# EAGLE design watch_rev3 (EAGLE 6.6.0)
Pulsar P3 Replacement Module 'Odin' made by Roy Schneider 2020
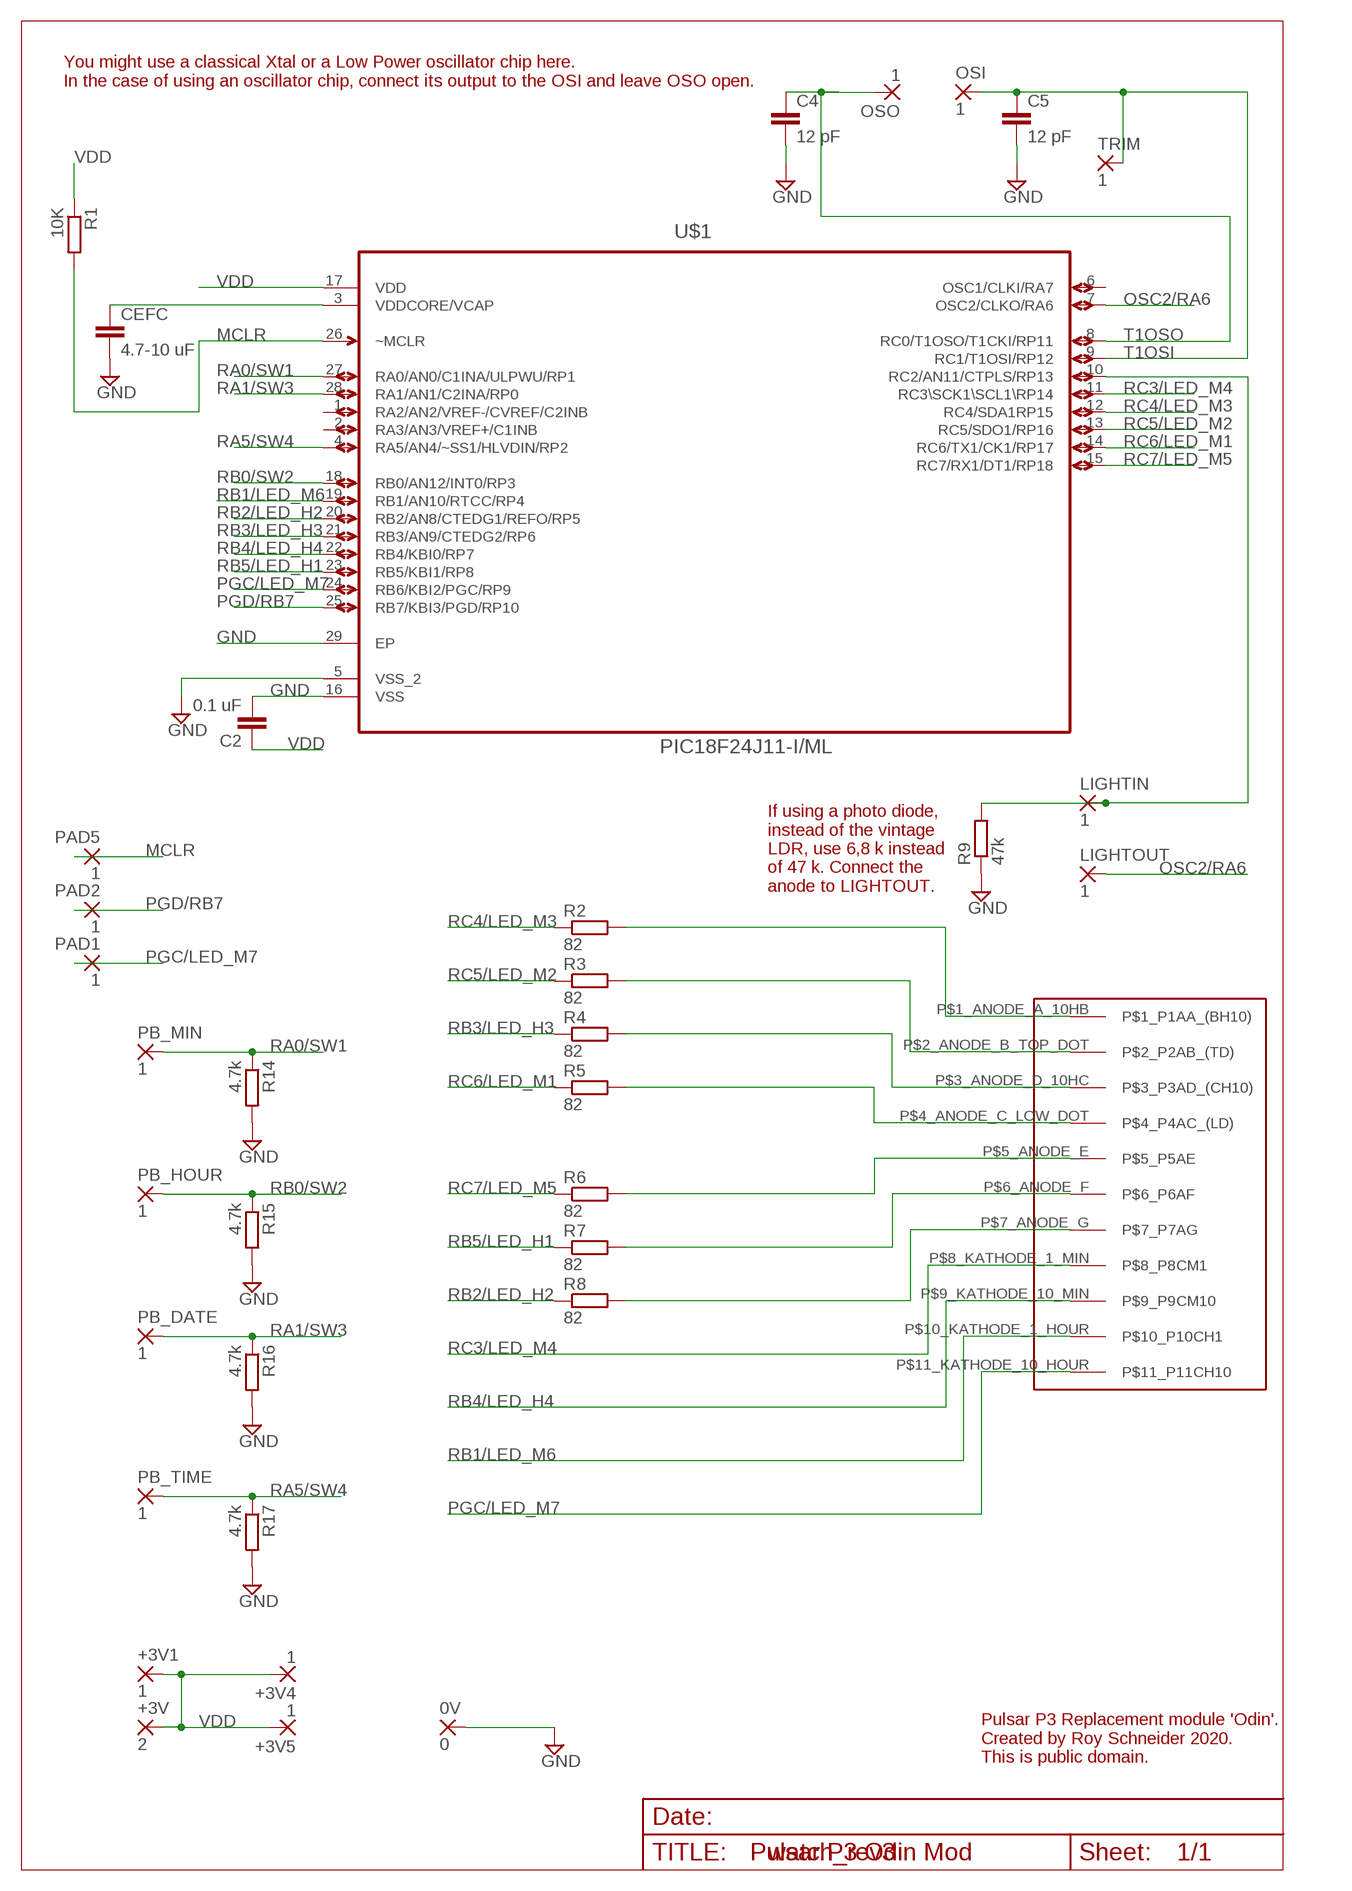
[diagram p0: schematic, sheet 1]

## Parts
0V  0  SMD2  [SMD1,27-2,54]
+3V  2  SMD2  [SMD1,27-2,54]
+3V1  1  SMD2  [SMD1,27-2,54]
+3V4  1  SMD2  [SMD1,27-2,54]
+3V5  1  SMD2  [SMD1,27-2,54]
C2  0.1 uF  C-EUC0603  [C0603]
C4  12 pF  C-EUC0603  [C0603]
C5  12 pF  C-EUC0603  [C0603]
CEFC  4.7-10 uF  C-EUC0603  [C0603]
LIGHTIN  1  SMD2  [SMD1,27-2,54]
LIGHTOUT  1  SMD2  [SMD1,27-2,54]
OSI  1  SMD2  [SMD1,27-2,54]
OSO  1  SMD2  [SMD1,27-2,54]
PAD1  1  SMD2  [SMD1,27-2,54]
PAD2  1  SMD2  [SMD1,27-2,54]
PAD5  1  SMD2  [SMD1,27-2,54]
PB_DATE  1  SMD2  [SMD1,27-2,54]
PB_HOUR  1  SMD2  [SMD1,27-2,54]
PB_MIN  1  SMD2  [SMD1,27-2,54]
PB_TIME  1  SMD2  [SMD1,27-2,54]
R1  10K  R-EU_R0402  [R0402]
R2  82  R-EU_R0402  [R0402]
R3  82  R-EU_R0402  [R0402]
R4  82  R-EU_R0402  [R0402]
R5  82  R-EU_R0402  [R0402]
R6  82  R-EU_R0402  [R0402]
R7  82  R-EU_R0402  [R0402]
R8  82  R-EU_R0402  [R0402]
R9  47k  R-EU_R0402  [R0402]
R14  4.7k  R-EU_R0402  [R0402]
R15  4.7k  R-EU_R0402  [R0402]
R16  4.7k  R-EU_R0402  [R0402]
R17  4.7k  R-EU_R0402  [R0402]
TRIM  1  SMD2  [SMD1,27-2,54]
U$1  PIC18F24J11-I/ML  [QFN65P600X600X100-29N]
U$3  PULSAR_P3_DISPLAY  [PULSAR_P3_LED_DISPLAY]

## Nets
GND: 0V.1(P) C2.2 C4.2 C5.2 CEFC.2 R9.1 R14.2 R15.2 R16.2 R17.2 U$1.5(VSS_2) U$1.16(VSS) U$1.29(EP)
MCLR: PAD5.1(P) R1.2 U$1.26(~MCLR)
N$1: LIGHTIN.1(P) R9.2 U$1.10(RC2/AN11/CTPLS/RP13)
N$2: R2.2 U$3.P$1_ANODE_A_10HB(P$1_P1AA_(BH10))
N$3: R3.2 U$3.P$2_ANODE_B_TOP_DOT(P$2_P2AB_(TD))
N$6: R4.2 U$3.P$3_ANODE_D_10HC(P$3_P3AD_(CH10))
N$7: R5.2 U$3.P$4_ANODE_C_LOW_DOT(P$4_P4AC_(LD))
N$8: R6.2 U$3.P$5_ANODE_E(P$5_P5AE)
N$9: R7.2 U$3.P$6_ANODE_F(P$6_P6AF)
N$10: R8.2 U$3.P$7_ANODE_G(P$7_P7AG)
OSC2/RA6: LIGHTOUT.1(P) U$1.7(OSC2/CLKO/RA6)
PGC/LED_M7: PAD1.1(P) U$1.24(RB6/KBI2/PGC/RP9) U$3.P$11_KATHODE_10_HOUR(P$11_P11CH10)
PGD/RB7: PAD2.1(P) U$1.25(RB7/KBI3/PGD/RP10)
RA0/SW1: PB_MIN.1(P) R14.1 U$1.27(RA0/AN0/C1INA/ULPWU/RP1)
RA1/SW3: PB_DATE.1(P) R16.1 U$1.28(RA1/AN1/C2INA/RP0)
RA5/SW4: PB_TIME.1(P) R17.1 U$1.4(RA5/AN4/~SS1/HLVDIN/RP2)
RB0/SW2: PB_HOUR.1(P) R15.1 U$1.18(RB0/AN12/INT0/RP3)
RB1/LED_M6: U$1.19(RB1/AN10/RTCC/RP4) U$3.P$10_KATHODE_1_HOUR(P$10_P10CH1)
RB2/LED_H2: R8.1 U$1.20(RB2/AN8/CTEDG1/REFO/RP5)
RB3/LED_H3: R4.1 U$1.21(RB3/AN9/CTEDG2/RP6)
RB4/LED_H4: U$1.22(RB4/KBI0/RP7) U$3.P$9_KATHODE_10_MIN(P$9_P9CM10)
RB5/LED_H1: R7.1 U$1.23(RB5/KBI1/RP8)
RC3/LED_M4: U$1.11(RC3\SCK1\SCL1\RP14) U$3.P$8_KATHODE_1_MIN(P$8_P8CM1)
RC4/LED_M3: R2.1 U$1.12(RC4/SDA1RP15)
RC5/LED_M2: R3.1 U$1.13(RC5/SDO1/RP16)
RC6/LED_M1: R5.1 U$1.14(RC6/TX1/CK1/RP17)
RC7/LED_M5: R6.1 U$1.15(RC7/RX1/DT1/RP18)
T1OSI: C5.1 OSI.1(P) TRIM.1(P) U$1.9(RC1/T1OSI/RP12)
T1OSO: C4.1 OSO.1(P) U$1.8(RC0/T1OSO/T1CKI/RP11)
VDD: +3V1.1(P) +3V4.1(P) +3V5.1(P) +3V.1(P) C2.1 R1.1 U$1.17(VDD)
VDDCORE/VCAP: CEFC.1 U$1.3(VDDCORE/VCAP)
Unconnected: U$1.1(RA2/AN2/VREF-/CVREF/C2INB) U$1.2(RA3/AN3/VREF+/C1INB) U$1.6(OSC1/CLKI/RA7)

## Notes on the sheet
- You might use a classical Xtal or a Low Power oscillator chip here.
  In the case of using an oscillator chip, connect its output to the OSI and leave OSO open.
- If using a photo diode,
  instead of the vintage
  LDR, use 6,8 k instead
  of 47 k. Connect the
  anode to LIGHTOUT.
- Pulsar P3 Replacement module 'Odin'.
  Created by Roy Schneider 2020.
  This is public domain.
- Pulsar P3 Odin Mod

## Library data of the parts
0V +3V +3V1 +3V4 +3V5 LIGHTIN LIGHTOUT OSI OSO PAD1 PAD2 PAD5 PB_DATE PB_HOUR PB_MIN PB_TIME TRIM = wirepad:SMD2: SMD PAD
C2 C4 C5 CEFC = resistor:C-EU: CAPACITOR, European symbol
R1 = rcl:R-EU_: RESISTOR, European symbol
R2-R9 R14-R17 = resistor:R-EU_: RESISTOR, European symbol
U$1 = pic18f24j11:PIC18F24J11-I/ML: 8BIT MCU; DESCRIPTION: 8BIT MCU; MPN: PIC18F24J11-I/Ml; OC_FARNELL: 1707634; OC_NEWARK: 98M1764; PACKAGE: QFN-28; SUPPLIER: Microchip
U$3 = pulsar_p3_display:PULSAR_P3_DISPLAY: Vintage Pulsar P3 Display made by Litronix.

## Net classes
0 default: clearance 0.205 mm

## Board
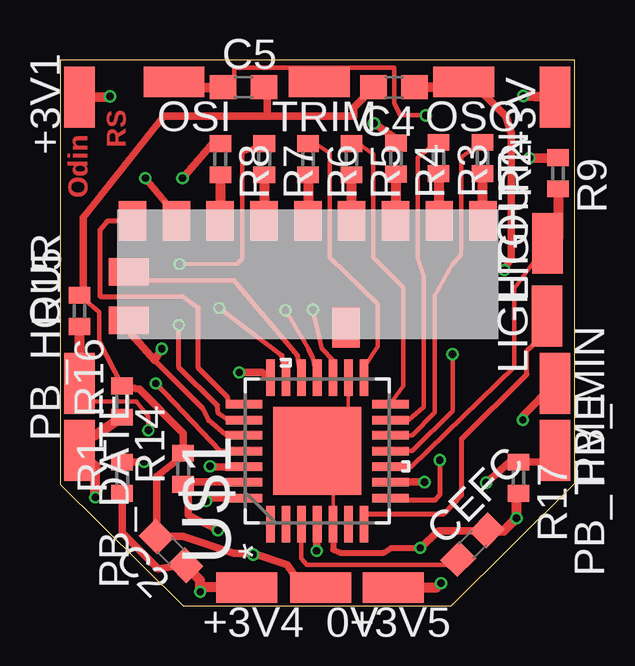
[diagram p1: board, top side]
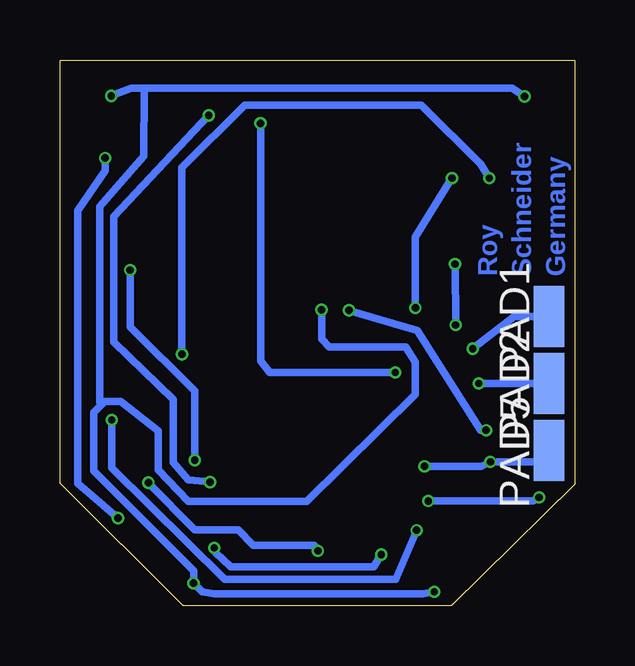
[diagram p2: board, bottom side, seen from below]

Size 21.44 x 22.76 mm. Coordinates in mm from the lower left corner, seen from the top.
Outline: 5.13,0 16.31,0 21.44,5.11 21.44,22.76 0,22.76 0,5.05 5.13,0
Copper layers (1*16): Top 0.035mm / dielectric 1.5mm / Bottom 0.035mm
Design rules "default *": minimum track width 6mil, minimum drill 12mil, track to track 4mil, track to pad 4mil, pad to pad 4mil, via to via 4mil, smd to smd 4mil, copper to edge 5mil, drill to drill 8mil, minimum pad ring 5mil, minimum via ring 4mil, stop-mask expansion 4mil, vias tented up to drill 0mil, thermal gap 5mil

### Footprints (pad centres in the part's own frame; a part is rotated, then mirrored left to right if it is on the bottom)
SMD1,27-2,54 = smd 1.27 x 2.54: 1 0,0
C0603 = smd 1.1 x 1: 1 -0.85,0; 2 0.85,0
R0402 = smd 0.7 x 0.9: 1 -0.65,0; 2 0.65,0
QFN65P600X600X100-29N = smd 1.524 x 0.356: 1 -3.048,1.956; 2 -3.048,1.295; 3 -3.048,0.66; 4 -3.048,0; 5 -3.048,-0.66; 6 -3.048,-1.295; 7 -3.048,-1.956; 15 3.048,-1.956; 16 3.048,-1.295; 17 3.048,-0.66; 18 3.048,0; 19 3.048,0.66; 20 3.048,1.295; 21 3.048,1.956 | smd 0.356 x 1.524: 8 -1.956,-3.048; 9 -1.295,-3.048; 10 -0.66,-3.048; 11 0,-3.048; 12 0.66,-3.048; 13 1.295,-3.048; 14 1.956,-3.048; 22 1.956,3.048; 23 1.295,3.048; 24 0.66,3.048; 25 0,3.048; 26 -0.66,3.048; 27 -1.295,3.048; 28 -1.956,3.048 | smd 3.658 x 3.658: 29 0,0
PULSAR_P3_LED_DISPLAY = smd 1.143 x 1.651: P$1_ANODE_A_10HB 15.24,4.921; P$2_ANODE_B_TOP_DOT 13.414,4.921; P$3_ANODE_D_10HC 11.589,4.921; P$4_ANODE_C_LOW_DOT 9.763,4.921; P$5_ANODE_E 7.938,4.921; P$6_ANODE_F 6.112,4.921; P$7_ANODE_G 4.286,4.921; P$8_KATHODE_1_MIN 2.461,4.921; P$9_KATHODE_10_MIN 0.635,4.921; P$12 9.525,0.476 | smd 1.651 x 1.143: P$10_KATHODE_1_HOUR 0.476,2.8; P$11_KATHODE_10_HOUR 0.476,0.787

### Placement (x,y rotation side)
0V  10.87,0.76 90 top
+3V  20.62,21.21 0 top
+3V1  0.81,21.21 0 top
+3V4  7.77,0.76 90 top
+3V5  13.89,0.76 90 top
C2  4.62,2.29 135 top
C4  13.92,21.62 180 top
C5  7.65,21.62 0 top
CEFC  17.2,2.54 45 top
LIGHTIN  20.32,15.11 0 top
LIGHTOUT  20.29,12.09 0 top
OSI  4.75,21.84 90 top
OSO  16.81,21.84 90 top
PAD1  1.07,12.06 0 bottom
PAD2  1.07,9.27 0 bottom
PAD5  1.07,6.48 0 bottom
PB_DATE  0.81,6.48 180 top
PB_HOUR  0.81,9.27 0 top
PB_MIN  20.62,9.27 180 top
PB_TIME  20.62,6.48 180 top
R1  2.59,5.33 90 top
R2  17.6,18.67 270 top
R3  15.77,18.67 270 top
R4  14,18.64 270 top
R5  12.14,18.62 270 top
R6  10.34,18.62 270 top
R7  8.51,18.62 270 top
R8  6.68,18.62 270 top
R9  20.75,18.03 270 top
R14  5.13,5.71 90 top
R15  0.81,12.29 90 top
R16  2.59,8.51 90 top
R17  19.1,5.33 270 top
TRIM  10.79,21.84 90 top
U$1  10.72,6.45 90 top
U$3  2.39,11.13 0 top

### Tracks (layer width: path | path; a pad name or v marks a point on that pad's centre or on a via)
GND  (via drill 0.3)
  Top 0.152: 19.1,4.45 R17.2 | U$1.16 12.01,7.64 U$1.29 11.38,5.69 U$1.5 11.43,3.25 11.38,3.25 | 17.73,3.12 CEFC.2 | 5.13,6.27 R14.2 5.11,6.43 | 4.04,2.9 C2.2 4.11,2.9 | 0.94,12.88 R15.2 0.96,13.03 | R16.2 2.64,9.12 | C5.2 8.84,21.57 8.64,21.57 | 10.11,0.76 0V.1 | v8.05,2.13 8.05,2.18 | 20.47,18.67 R9.1
  Top 0.178: R16.2 1.63,11.02 1.63,12.24 R15.2
  Top 0.254: v15.01,2.41 13.79,2.41 13.49,2.21 11.66,2.21 11.38,2.34 11.38,3.25
  Top 0.305: 17.73,3.12 15.77,3.12 v15.01,2.41 | 5.13,6.27 4.04,5.38 4.04,2.9 | 8.64,20.42 4.32,20.42 0.96,16.18 0.96,13.03 | 2.64,9.12 3.3,9.04 5.13,7.19 R14.2 | 10.11,0.76 9.47,1.7 8.05,2.18 7.24,2.18 5.13,2.9 4.11,2.9 | 8.64,21.57 8.64,20.42 | 8.64,20.42 12.24,20.42 12.24,20.76 C4.2
  Top 0.406: CEFC.2 18.51,3.14 v19.02,3.66 19.02,4.61 R17.2 | v19.56,18.67 R9.1
  Bottom 0.305: v19.56,18.67 19.56,18.14 20.7,16.48 20.7,5.11 v19.02,3.66 | v15.01,2.41 14.96,2.23 14.33,1.63 8.36,1.63 v8.05,2.13
MCLR  (via drill 0.3)
  Top 0.152: 2.59,5.99 R1.2
  Top 0.305: v3.5,5.99 2.59,5.99 | U$1.26 6.35,5.79 v6.25,5.82
  Bottom 0.152: PAD5.1 1.55,5.99
  Bottom 0.305: 1.55,5.99 v3.5,5.99 3.89,5.82 v6.25,5.82
N$1
  Top 0.152: LIGHTIN.1 20.75,15.16
  Top 0.178: U$1.10 14.63,5.79 18.92,9.96 18.92,13.23 LIGHTIN.1
  Top 0.406: R9.2 20.75,15.32 LIGHTIN.1
N$2
  Top 0.152: 17.6,15.58 U$3.P$1_ANODE_A_10HB
  Top 0.406: R2.2 17.6,16.07 U$3.P$1_ANODE_A_10HB
N$3
  Top 0.152: 15.77,15.58 U$3.P$2_ANODE_B_TOP_DOT
  Top 0.406: R3.2 15.77,16.07 U$3.P$2_ANODE_B_TOP_DOT
N$6
  Top 0.152: 13.89,15.59 U$3.P$3_ANODE_D_10HC
  Top 0.406: R4.2 14,16.07 U$3.P$3_ANODE_D_10HC
N$7
  Top 0.152: 12.09,15.57 U$3.P$4_ANODE_C_LOW_DOT
  Top 0.406: R5.2 U$3.P$4_ANODE_C_LOW_DOT
N$8
  Top 0.152: 10.29,15.57 U$3.P$5_ANODE_E
  Top 0.406: R6.2 10.34,16.06 U$3.P$5_ANODE_E
N$9
  Top 0.406: R7.2 U$3.P$6_ANODE_F
N$10
  Top 0.152: 6.65,15.59 U$3.P$7_ANODE_G
  Top 0.406: R8.2 U$3.P$7_ANODE_G
OSC2/RA6
  Top 0.152: U$1.7 12.67,3.83 | 20.62,11.68 LIGHTOUT.1
  Top 0.203: 12.67,3.83 16,3.83 16.74,4.6 16.74,6.96 19.46,9.65 19.46,10.64 20.62,11.68
PGC/LED_M7  (via drill 0.3)
  Top 0.152: 2.97,11.33 U$3.P$11_KATHODE_10_HOUR
  Top 0.203: 3.95,10.22 5.94,8.23 6.2,7.72 6.93,7.11 U$1.24
  Top 0.305: 2.97,11.33 3.95,10.22 v4.24,10.72
  Bottom 0.305: PAD1.1 2.51,12.06 v4.24,10.72
PGD/RB7  (via drill 0.3)
  Top 0.203: U$1.25 6.65,6.45 v3.99,9.27
  Bottom 0.305: PAD2.1 v3.99,9.27
RA0/SW1  (via drill 0.3)
  Top 0.152: 5.13,5.16 R14.1 5.33,5
  Top 0.305: U$1.27 5.13,5.16 | 5.33,5 5.33,3.79 v6.58,3.15 | v19.28,7.75 19.28,7.92 PB_MIN.1
  Bottom 0.305: v6.58,3.15 7.44,1.09 14.58,1.09 19.28,5.74 v19.28,7.75
RA1/SW3  (via drill 0.3)
  Top 0.152: PB_DATE.1 1.42,7.09 | R16.1
  Top 0.305: U$1.28 6.22,4.5 v6.1,4.37
  Top 0.406: v1.47,4.52 1.47,5.82 PB_DATE.1 | 1.42,7.09 R16.1
  Bottom 0.305: v6.1,4.37 1.73,4.37 v1.47,4.52
RA5/SW4  (via drill 0.3)
  Top 0.152: PB_TIME.1 20.14,5.99 | R17.1 19.1,5.99 18.74,5.99
  Top 0.305: 20.14,5.99 19.1,5.99 | 18.74,5.99 v17.75,5.13 | U$1.4 v10.69,2.29
  Bottom 0.305: v17.75,5.13 15.82,3.17 14.02,3.17 13.39,2.52 10.85,2.52 v10.69,2.29
RB0/SW2  (via drill 0.3)
  Top 0.152: 0.94,11.66 R15.1 | PB_HOUR.1 0.81,8.59 0.84,8.56 0.84,8.51
  Top 0.178: U$1.18 10.54,10.34 10.34,10.72 10.19,11.02 v9.4,12.32 | v3.68,7.32 3.68,7.9 3.17,8.51 0.84,8.51
  Top 0.406: PB_HOUR.1 R15.1
  Bottom 0.305: v9.4,12.32 6.55,11.48 3.91,7.32 v3.68,7.32
RB1/LED_M6
  Top 0.203: U$1.19 9.91,10.44 7.26,13.56 3.73,13.56 U$3.P$10_KATHODE_1_HOUR
RB2/LED_H2  (via drill 0.3)
  Top 0.152: 6.38,19.3 6.78,19.3 R8.1
  Top 0.203: v6.63,12.42 7.09,12.06 9.25,10.44 U$1.20
  Top 0.305: v5.11,17.83 6.38,19.3
  Bottom 0.305: v5.11,17.83 6.63,15.37 v6.63,12.42
RB3/LED_H3  (via drill 0.3)
  Top 0.152: 14.22,19.33 13.77,19.33 R4.1
  Top 0.305: v13.08,20.12 14.22,19.33 | v7.47,9.73 8.43,9.73 U$1.21
  Bottom 0.305: v13.08,20.12 13.08,10.21 12.7,9.73 v7.47,9.73
RB4/LED_H4
  Top 0.152: U$3.P$9_KATHODE_10_MIN
  Top 0.203: U$1.22 7.06,8.41 6.98,8.69 5.77,9.91 5.77,12.42 5.11,12.9 1.68,12.9 1.68,15.67 2.01,16.05 U$3.P$9_KATHODE_10_MIN
RB5/LED_H1  (via drill 0.3)
  Top 0.152: 8.69,19.23 R7.1
  Top 0.178: v4.98,14.25 7.37,14.25 7.59,14.48 7.59,18.9 R7.1
  Top 0.203: v4.95,11.71 4.95,9.93 6.55,8.36 6.6,8.03 7.01,7.75 U$1.23
  Bottom 0.305: v4.95,11.71 v4.98,14.25
RC3/LED_M4  (via drill 0.3)
  Top 0.152: 4.88,16.23 U$3.P$8_KATHODE_1_MIN
  Top 0.178: v16.36,10.49 16.36,8.13 14.68,6.45 U$1.11
  Top 0.305: v3.56,17.83 4.88,16.23
  Bottom 0.305: v3.56,17.83 3.91,18.41 6.38,20.88 13.74,20.88 16.36,18.26 v16.36,10.49
RC4/LED_M3
  Top 0.152: 17.58,19.3 17.56,19.3 R2.1
  Top 0.178: U$1.12 14.68,7.11 15.61,8.05 15.61,12.93 16.33,14.2 16.69,14.61 16.73,14.96 16.73,18.71 17.58,19.3
RC5/LED_M2
  Top 0.152: 15.67,19.3 15.66,19.3 R3.1
  Top 0.178: U$1.13 14.53,7.75 15.16,8.28 15.16,13.74 14.9,14.49 14.9,18.68 15.67,19.3
RC6/LED_M1
  Top 0.152: 12.5,19.23 R5.1
  Top 0.178: 12.5,19.23 13.06,18.82 13.06,14.53 14.3,13.26 14.3,9.17 U$1.14
RC7/LED_M5
  Top 0.152: U$1.15 12.67,9.96 | 10.59,19.3 10.61,19.3 R6.1
  Top 0.178: 12.67,9.96 13.23,10.82 13.23,12.57 11.24,14.53 11.24,18.87 10.59,19.3
T1OSI  (via drill 0.3)
  Top 0.152: OSI.1 5,21.59 | 7.26,21.61 C5.1 | 11.33,22.43 TRIM.1
  Top 0.178: v15.24,20.45 14.17,20.45 13.92,20.95 13.92,22.43 11.33,22.43 7.26,22.43 7.26,21.61
  Top 0.305: v15.19,5.16 U$1.9
  Top 0.406: 5,21.59 C5.1
  Bottom 0.305: v15.19,5.16 16.1,5.26 16.71,5.97 16.71,8.61 19.2,11 19.2,16.23 v15.24,20.45
T1OSO  (via drill 0.3)
  Top 0.152: 16.56,21.59 OSO.1 16.87,22.1
  Top 0.178: 14.22,4.39 U$1.8
  Top 0.203: v15.82,6.07 15.82,4.65 15.62,4.39 14.22,4.39
  Top 0.305: 16.87,22.1 18.57,20.42 18.8,19.71 18.8,14.53 v18.52,13.99
  Top 0.406: 16.56,21.59 C4.1
  Bottom 0.305: v15.82,6.07 15.82,8.97 18.52,11.63 v18.52,13.99
VDD  (via drill 0.3)
  Top 0.152: +3V.1 20.57,21.26 | 5.21,1.7 C2.1 5.28,1.65
  Top 0.178: U$1.17 11.38,10.24 10.9,10.72 v10.54,12.34
  Top 0.305: R1.1 2.59,3.05 4.09,1.55 5.21,1.7
  Top 0.406: +3V5.1 15.7,0.76 v15.87,0.94 | +3V4.1 6.02,0.76 v5.84,0.58 5.84,1.07 C2.1 | v19.3,21.26 +3V.1 | +3V1.1 v2.08,21.23
  Bottom 0.152: 19.58,8.51 19.66,8.43 19.79,8.48 | 19.35,21.21 v19.3,21.26
  Bottom 0.305: v10.54,12.34 10.54,11.12 10.21,10.79 7.04,10.79 6.63,10.16 6.63,8.81 11.15,4.34 16.1,4.34 17.35,5.66 17.35,7.29 18.9,8.51 19.58,8.51 | 19.66,8.43 20.04,8.05 20.04,5.61 15.87,1.45 v15.87,0.94 15.52,0.58 15.01,0.51 6.32,0.51 v5.84,0.58 | 19.79,8.48 19.79,16.64 17.96,18.75 17.93,21.59 | v19.3,21.26 18.47,21.59 17.93,21.59 | 17.93,21.59 2.59,21.59 v2.08,21.23
VDDCORE/VCAP
  Top 0.178: U$1.3 10.06,1.98 10.29,1.7 16.28,1.7
  Top 0.203: 16.28,1.7 CEFC.1

### Text on the board
Top: RS | Odin | Odin
Bottom: Roy / Schneider / Germany